# EAGLE design clock (EAGLE 5.11)
FARNELL_PARTNO: AMP 3-1825910-5

## Sheet 1 of 4
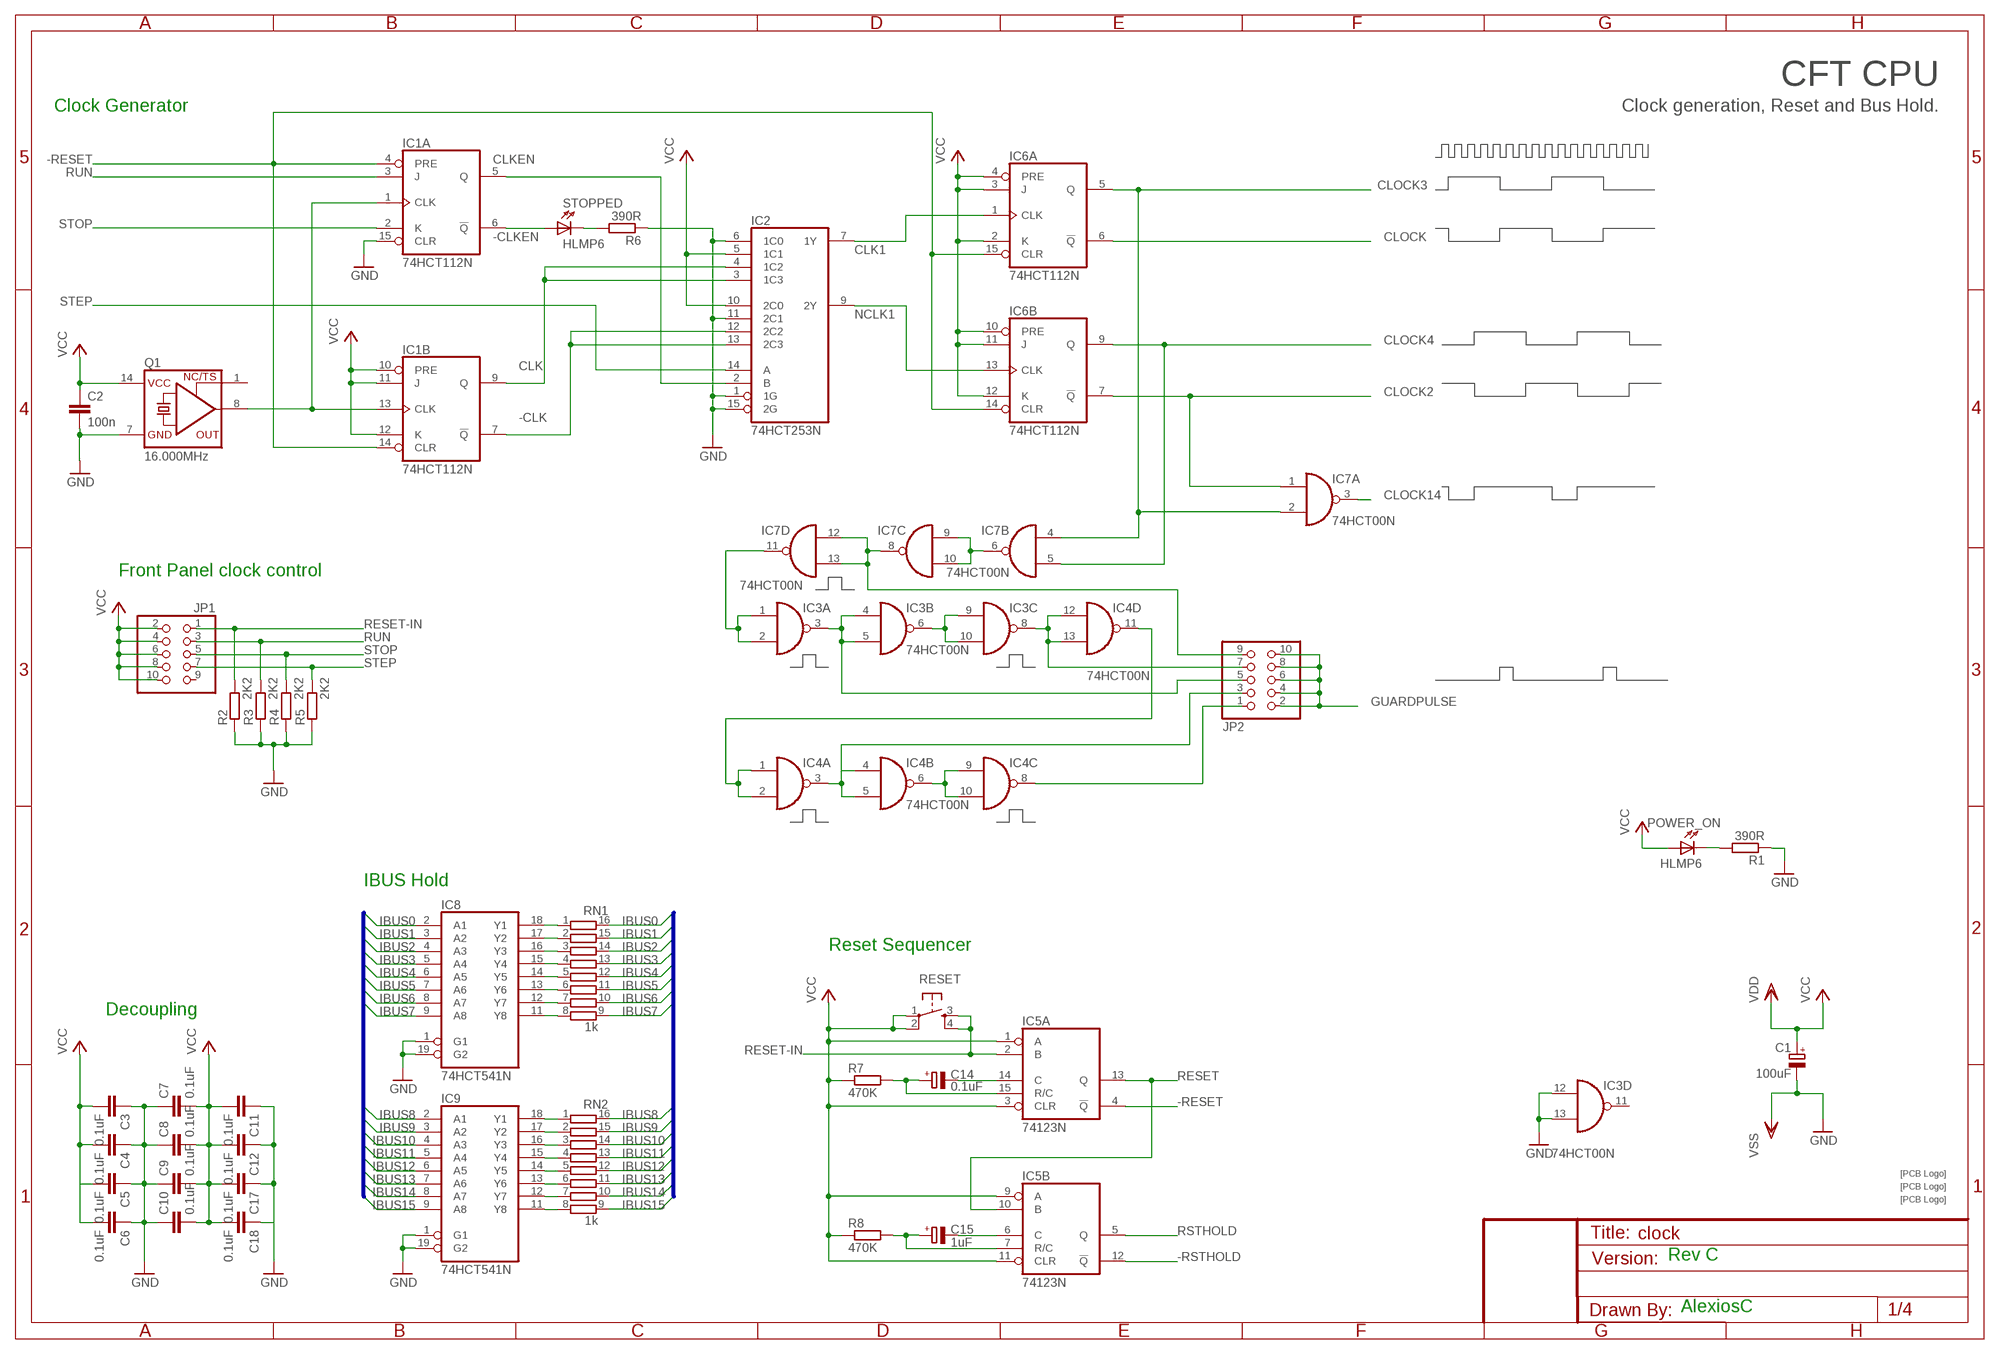
[diagram p0: schematic, sheet 1]

### Parts
C1  100uF  CPOL-EUE2.5-7  [E2,5-7]
C2  100n  C-EU025-025X050  [C025-025X050]
C3  0.1uF  C-EU025-025X050  [C025-025X050]
C4  0.1uF  C-EU025-025X050  [C025-025X050]
C5  0.1uF  C-EU025-025X050  [C025-025X050]
C6  0.1uF  C-EU025-025X050  [C025-025X050]
C7  0.1uF  C-EU025-025X050  [C025-025X050]
C8  0.1uF  C-EU025-025X050  [C025-025X050]
C9  0.1uF  C-EU025-025X050  [C025-025X050]
C10  0.1uF  C-EU025-025X050  [C025-025X050]
C11  0.1uF  C-EU025-025X050  [C025-025X050]
C12  0.1uF  C-EU025-025X050  [C025-025X050]
C14  0.1uF  CPOL-EUE2.5-6  [E2,5-6]
C15  1uF  CPOL-EUE2.5-6  [E2,5-6]
C17  0.1uF  C-EU025-025X050  [C025-025X050]
C18  0.1uF  C-EU025-025X050  [C025-025X050]
IC1  74HCT112N  [DIL16]
IC2  74HCT253N  [DIL16]
IC3  74HCT00N  [DIL14]
IC4  74HCT00N  [DIL14]
IC5  74123N  [DIL16]
IC6  74HCT112N  [DIL16]
IC7  74HCT00N  [DIL14]
IC8  74HCT541N  [DIL20]
IC9  74HCT541N  [DIL20]
JP1  PINHD-2X5/90  [2X05/90]
JP2  PINHD-2X5/90  [2X05/90]
POWER_ON  HLMP6  [HLMP6]
Q1  16.000MHz  XO-14  [DIL14S]
R1  390R  R-EU_0204/7  [0204/7]
R2  2K2  R-EU_0204/7  [0204/7]
R3  2K2  R-EU_0204/7  [0204/7]
R4  2K2  R-EU_0204/7  [0204/7]
R5  2K2  R-EU_0204/7  [0204/7]
R6  390R  R-EU_0204/7  [0204/7]
R7  470K  R-EU_0204/7  [0204/7]
R8  470K  R-EU_0204/7  [0204/7]
RESET  TAC_SWITCHPTH  [TACTILE-PTH]
RN1  1k  8R-P  [DIL16]
RN2  1k  8R-P  [DIL16]
STOPPED  HLMP6  [HLMP6]
U$1  SIGNATUREPLANE  [SIGNATURE_PLANE]
U$2  SIGNATUREPLANE  [SIGNATURE_PLANE]
U$3  SIGNATURESILK  [SIGNATURE]

### Nets
-CLK: IC1.7(B:!Q) IC2.12(2C2) IC2.13(2C3)
-CLKEN: IC1.6(A:!Q) STOPPED.A
-RESET: IC1.4(A:PRE) IC1.14(B:CLR) IC5.4(A:!Q) IC6.14(B:CLR) IC6.15(A:CLR) ; also sheet 2,4
-RSTHOLD: IC5.12(B:!Q) ; also sheet 3,4
CLK: IC1.9(B:Q) IC2.3(1C3) IC2.4(1C2)
CLK1: IC2.7(1Y) IC6.1(A:CLK)
CLKEN: IC1.5(A:Q) IC2.2(B)
CLOCK: IC6.6(A:!Q) ; also sheet 2,4
CLOCK2: IC6.7(B:!Q) IC7.1(A:I0) ; also sheet 4
CLOCK3: IC6.5(A:Q) IC7.2(A:I1) IC7.4(B:I0) ; also sheet 4
CLOCK4: IC6.9(B:Q) IC7.5(B:I1) ; also sheet 4
CLOCK14: IC7.3(A:O) ; also sheet 4
GND [Power]: C1.- C2.1 C3.1 C4.1 C5.1 C6.1 C7.1 C8.1 C9.1 C10.1 C11.1 C12.1 C17.1 C18.1 IC1.15(A:CLR) IC2.1(1G) IC2.6(1C0) IC2.11(2C1) IC2.15(2G) IC3.12(D:I0) IC3.13(D:I1) IC8.1(G1) IC8.19(G2) IC9.1(G1) IC9.19(G2) Q1.7(GND) R1.1 R2.1 R3.1 R4.1 R5.1 R6.1 ; supply symbol labelled VSS ; also sheet 2,3,4
GUARDPULSE: JP2.2 JP2.4 JP2.6 JP2.8 JP2.10 ; also sheet 4
IBUS0: IC8.2(A1) RN1.16 ; also sheet 3,4
IBUS1: IC8.3(A2) RN1.15 ; also sheet 3,4
IBUS2: IC8.4(A3) RN1.14 ; also sheet 3,4
IBUS3: IC8.5(A4) RN1.13 ; also sheet 3,4
IBUS4: IC8.6(A5) RN1.12 ; also sheet 3,4
IBUS5: IC8.7(A6) RN1.11 ; also sheet 3,4
IBUS6: IC8.8(A7) RN1.10 ; also sheet 3,4
IBUS7: IC8.9(A8) RN1.9 ; also sheet 3,4
IBUS8: IC9.2(A1) RN2.16 ; also sheet 3,4
IBUS9: IC9.3(A2) RN2.15 ; also sheet 3,4
IBUS10: IC9.4(A3) RN2.14 ; also sheet 3,4
IBUS11: IC9.5(A4) RN2.13 ; also sheet 3,4
IBUS12: IC9.6(A5) RN2.12 ; also sheet 3,4
IBUS13: IC9.7(A6) RN2.11 ; also sheet 3,4
IBUS14: IC9.8(A7) RN2.10 ; also sheet 3,4
IBUS15: IC9.9(A8) RN2.9 ; also sheet 3,4
N$1: POWER_ON.K R1.2
N$2: IC4.8(C:O) JP2.1
N$3: R6.2 STOPPED.K
N$4: IC8.18(Y1) RN1.1
N$5: IC1.1(A:CLK) IC1.13(B:CLK) Q1.8(OUT)
N$6: C14.+ IC5.15(A:R/C) R7.2
N$8: C14.- IC5.14(A:C)
N$9: C15.+ IC5.7(B:R/C) R8.2
N$10: C15.- IC5.6(B:C)
N$11: IC3.3(A:O) IC3.4(B:I0) IC3.5(B:I1) JP2.5
N$12: IC3.6(B:O) IC3.9(C:I0) IC3.10(C:I1)
N$13: IC3.8(C:O) IC4.12(D:I0) IC4.13(D:I1) JP2.7
N$14: IC4.1(A:I0) IC4.2(A:I1) IC4.11(D:O)
N$15: IC4.3(A:O) IC4.4(B:I0) IC4.5(B:I1) JP2.3
N$16: IC4.6(B:O) IC4.9(C:I0) IC4.10(C:I1)
N$17: IC8.17(Y2) RN1.2
N$18: IC7.6(B:O) IC7.9(C:I0) IC7.10(C:I1)
N$19: IC7.8(C:O) IC7.12(D:I0) IC7.13(D:I1) JP2.9
N$20: IC3.1(A:I0) IC3.2(A:I1) IC7.11(D:O)
N$21: IC8.16(Y3) RN1.3
N$22: IC8.15(Y4) RN1.4
N$23: IC8.14(Y5) RN1.5
N$24: IC8.13(Y6) RN1.6
N$25: IC8.12(Y7) RN1.7
N$26: IC8.11(Y8) RN1.8
N$27: IC9.18(Y1) RN2.1
N$28: IC9.17(Y2) RN2.2
N$29: IC9.16(Y3) RN2.3
N$30: IC9.15(Y4) RN2.4
N$31: IC9.14(Y5) RN2.5
N$32: IC9.13(Y6) RN2.6
N$33: IC9.12(Y7) RN2.7
N$34: IC9.11(Y8) RN2.8
NCLK1: IC2.9(2Y) IC6.13(B:CLK)
RESET: IC5.10(B:B) IC5.13(A:Q)
RESET-IN: IC5.2(A:B) JP1.1 R2.2 RESET.3 RESET.4
RSTHOLD: IC5.5(B:Q)
RUN: IC1.3(A:J) JP1.3 R3.2
STEP: IC2.14(A) JP1.7 R5.2
STOP: IC1.2(A:K) JP1.5 R4.2
VCC [Power]: C1.+ C2.2 C3.2 C4.2 C5.2 C6.2 C7.2 C8.2 C9.2 C10.2 C11.2 C12.2 C17.2 C18.2 IC1.10(B:PRE) IC1.11(B:J) IC1.12(B:K) IC2.5(1C1) IC2.10(2C0) IC5.1(A:A) IC5.3(A:CLR) IC5.9(B:A) IC5.11(B:CLR) IC6.2(A:K) IC6.3(A:J) IC6.4(A:PRE) IC6.10(B:PRE) IC6.11(B:J) IC6.12(B:K) JP1.2 JP1.4 JP1.6 JP1.8 JP1.10 POWER_ON.A Q1.14(VCC) R7.1 R8.1 RESET.1 RESET.2 ; supply symbol labelled VDD ; also sheet 2,3,4
Unconnected: IC3.11(D:O) JP1.9 Q1.1(TS)

### Buses
IBUS[0..15]

### Notes on the sheet
- CFT CPU
- Clock Generator | Clock generation, Reset and Bus Hold.
- Front Panel clock control
- IBUS Hold
- Reset Sequencer
- Decoupling
- Rev C
- AlexiosC

## Sheet 2 of 4
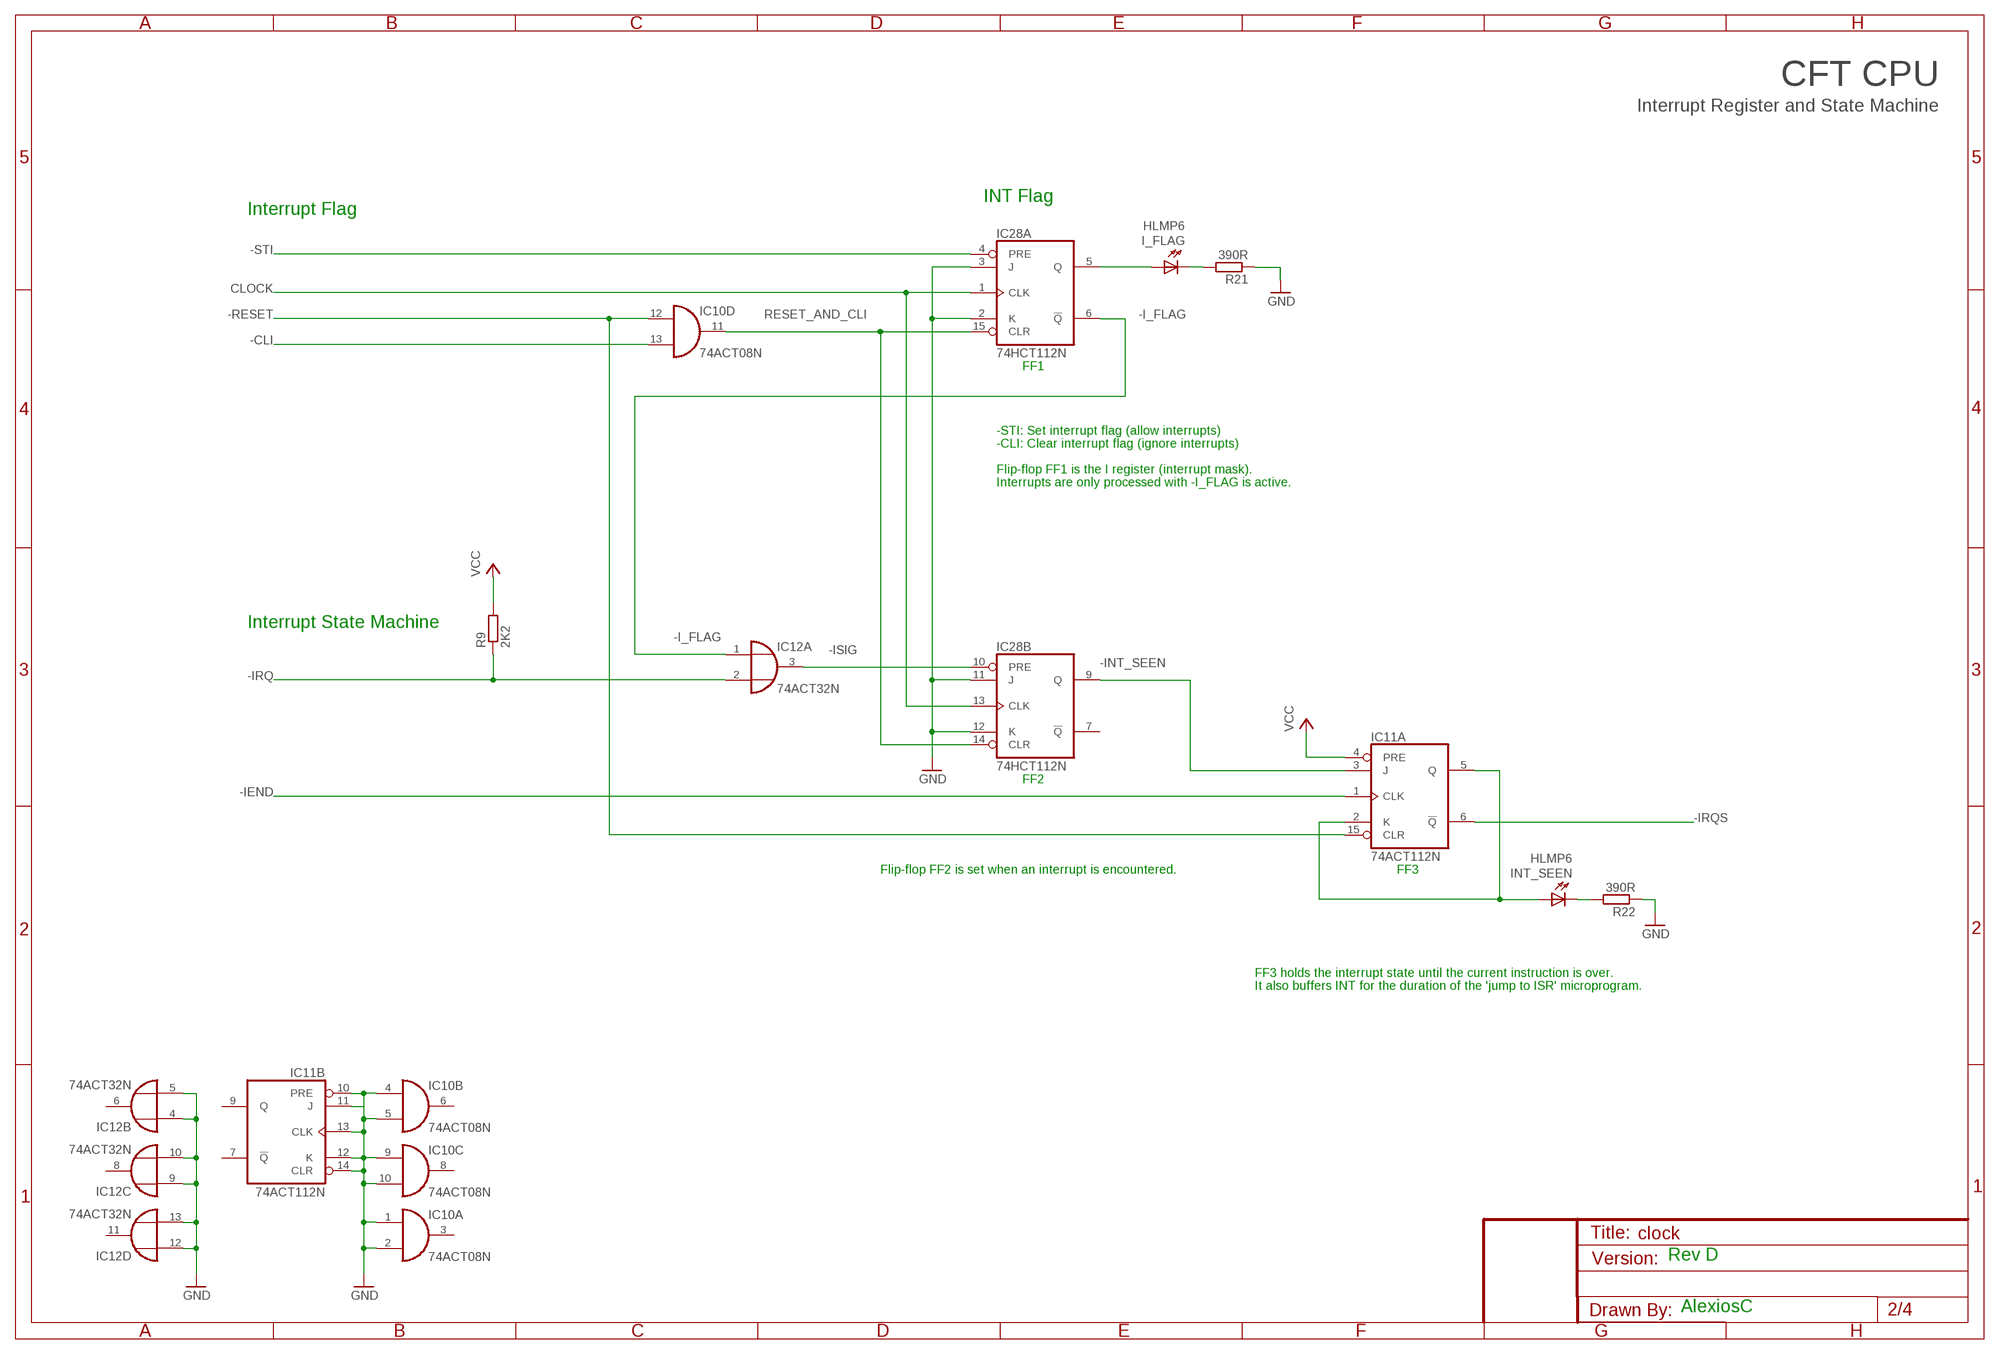
[diagram p1: schematic, sheet 2]

### Parts
I_FLAG  HLMP6  [HLMP6]
IC10  74ACT08N  [DIL14]
IC11  74ACT112N  [DIL16]
IC12  74ACT32N  [DIL14]
IC28  74HCT112N  [DIL16]
INT_SEEN  HLMP6  [HLMP6]
R9  2K2  R-EU_0204/7  [0204/7]
R21  390R  R-EU_0204/7  [0204/7]
R22  390R  R-EU_0204/7  [0204/7]

### Nets
-CLI: IC10.13(D:I1) ; also sheet 4
-I_FLAG: IC12.1(A:I0) IC28.6(A:!Q)
-IEND: IC11.1(A:CLK) ; also sheet 4
-INT_SEEN: IC11.3(A:J) IC28.9(B:Q)
-IRQ: IC12.2(A:I1) R9.1 ; also sheet 4
-IRQS: IC11.2(A:K) IC11.5(A:Q) IC11.6(A:!Q) INT_SEEN.A ; also sheet 4
-ISIG: IC12.3(A:O) IC28.10(B:PRE)
-RESET: IC10.12(D:I0) IC11.15(A:CLR) ; also sheet 1,4
-STI: IC28.4(A:PRE) ; also sheet 4
CLOCK: IC28.1(A:CLK) IC28.13(B:CLK) ; also sheet 1,4
GND [Power]: IC10.1(A:I0) IC10.2(A:I1) IC10.4(B:I0) IC10.5(B:I1) IC10.9(C:I0) IC10.10(C:I1) IC11.10(B:PRE) IC11.11(B:J) IC11.12(B:K) IC11.13(B:CLK) IC11.14(B:CLR) IC12.4(B:I0) IC12.5(B:I1) IC12.9(C:I0) IC12.10(C:I1) IC12.12(D:I0) IC12.13(D:I1) IC28.2(A:K) IC28.3(A:J) IC28.11(B:J) IC28.12(B:K) R21.1 R22.1 ; also sheet 1,3,4
I_FLAG2: I_FLAG.A IC28.5(A:Q)
N$76: I_FLAG.K R21.2
N$77: INT_SEEN.K R22.2
RESET_AND_CLI: IC10.11(D:O) IC28.14(B:CLR) IC28.15(A:CLR)
VCC [Power]: IC11.4(A:PRE) R9.2 ; also sheet 1,3,4
Unconnected: IC10.3(A:O) IC10.6(B:O) IC10.8(C:O) IC11.7(B:!Q) IC11.9(B:Q) IC12.6(B:O) IC12.8(C:O) IC12.11(D:O) IC28.7(B:!Q)

### Notes on the sheet
- CFT CPU
- Interrupt Register and State Machine
- INT Flag
- Interrupt Flag
- FF1
- -STI: Set interrupt flag (allow interrupts)
- -CLI: Clear interrupt flag (ignore interrupts)
- Flip-flop FF1 is the I register (interrupt mask).
- Interrupts are only processed with -I_FLAG is active.
- Interrupt State Machine
- FF2
- Flip-flop FF2 is set when an interrupt is encountered. | FF3
- FF3 holds the interrupt state until the current instruction is over.
- It also buffers INT for the duration of the 'jump to ISR' microprogram.
- Rev D
- AlexiosC

## Sheet 3 of 4
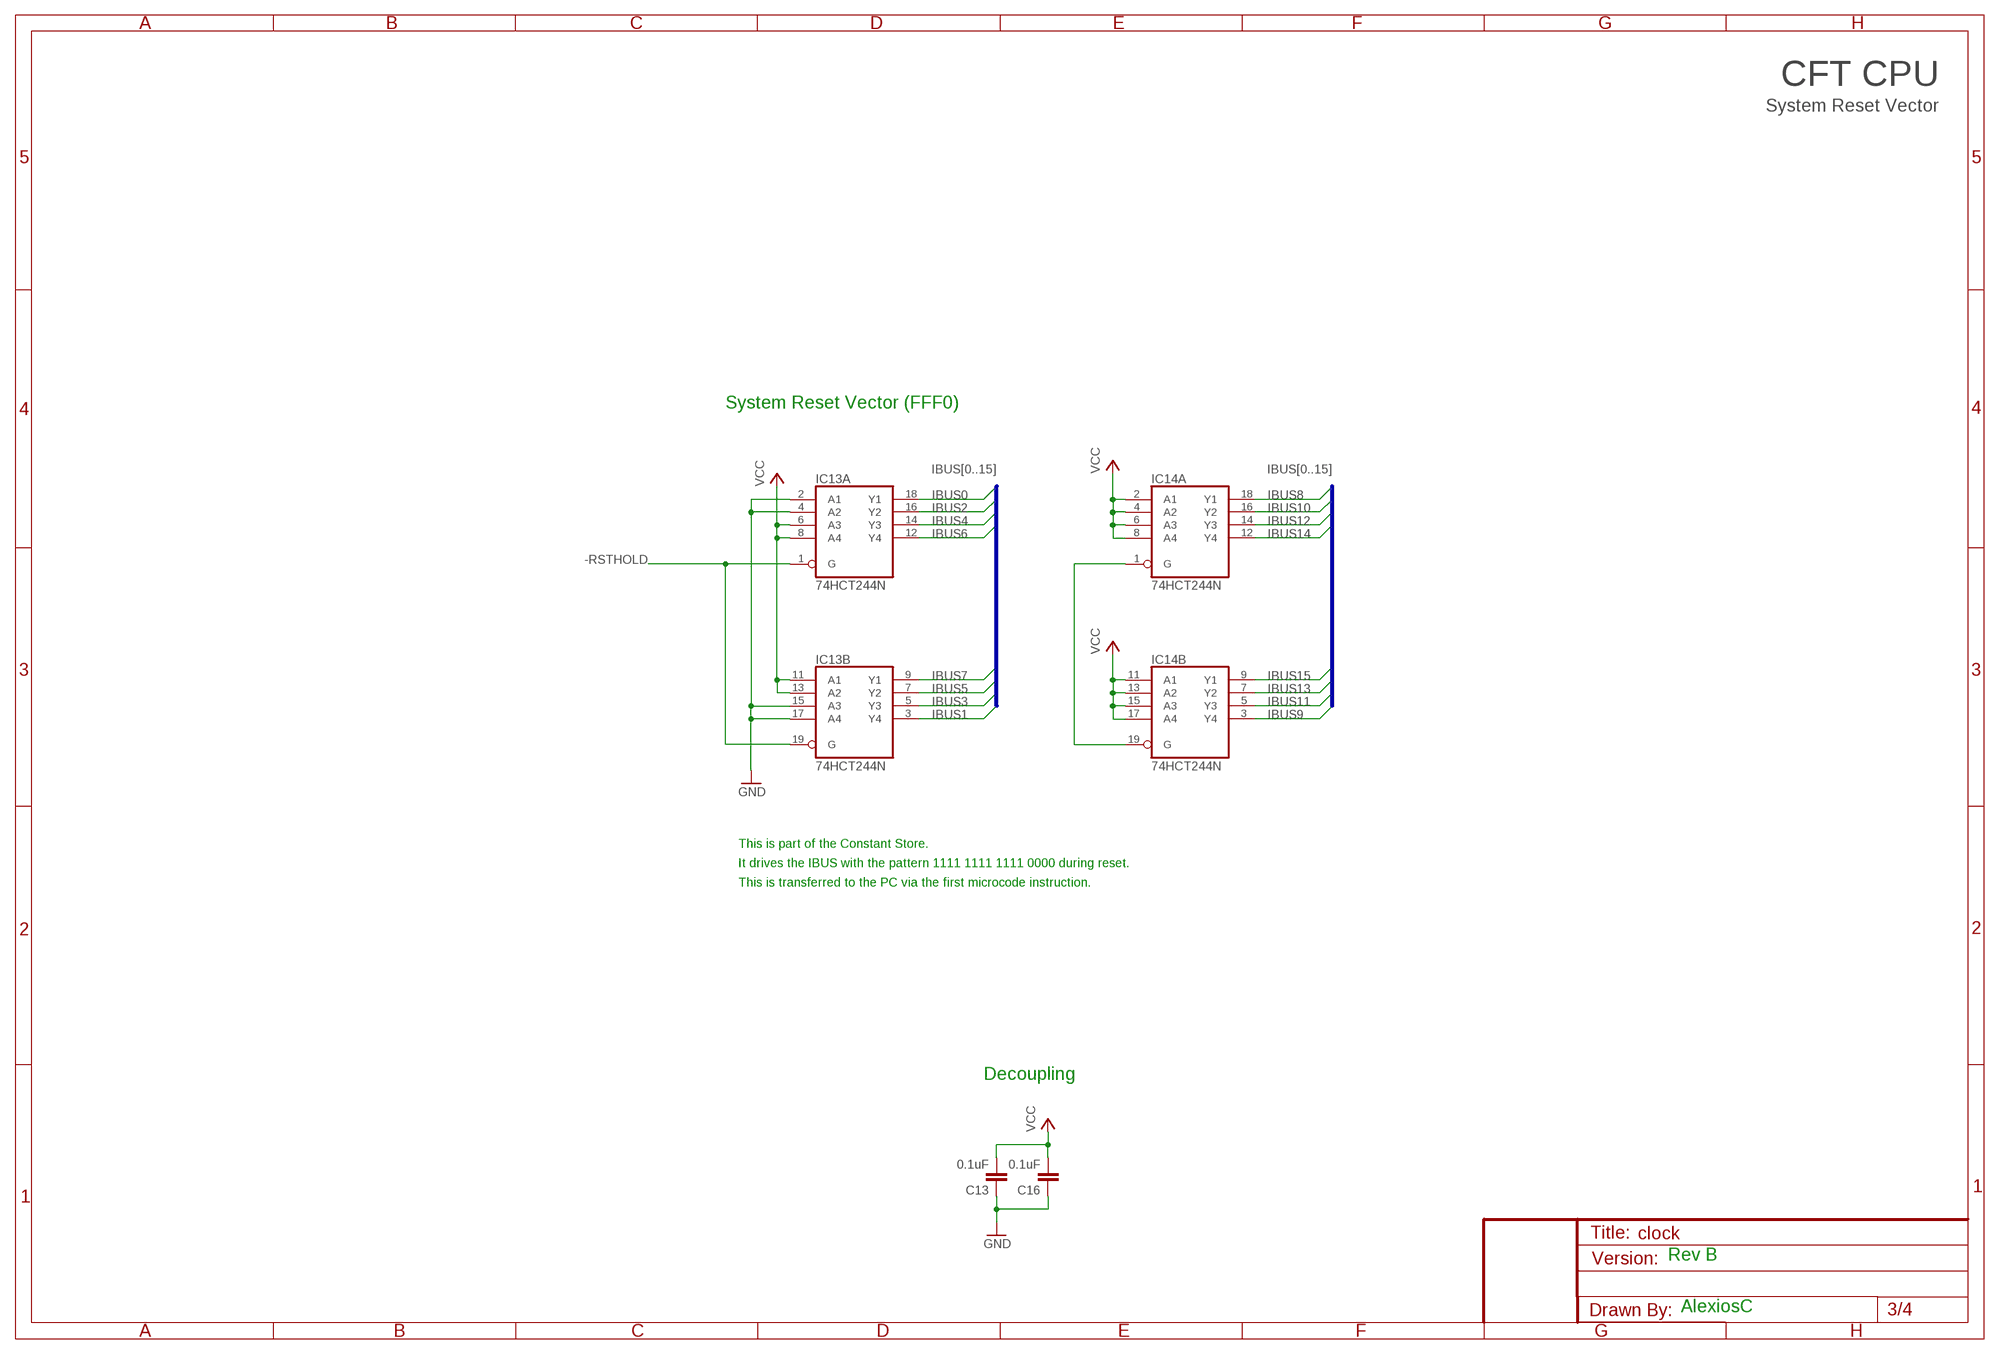
[diagram p2: schematic, sheet 3]

### Parts
C13  0.1uF  C-EU025-025X050  [C025-025X050]
C16  0.1uF  C-EU025-025X050  [C025-025X050]
IC13  74HCT244N  [DIL20]
IC14  74HCT244N  [DIL20]

### Nets
-RSTHOLD: IC13.1(A:G) IC13.19(B:G) ; also sheet 1,4
GND [Power]: C13.1 C16.1 IC13.2(A:A1) IC13.4(A:A2) IC13.15(B:A3) IC13.17(B:A4) ; also sheet 1,2,4
IBUS0: IC13.18(A:Y1) ; also sheet 1,4
IBUS1: IC13.3(B:Y4) ; also sheet 1,4
IBUS2: IC13.16(A:Y2) ; also sheet 1,4
IBUS3: IC13.5(B:Y3) ; also sheet 1,4
IBUS4: IC13.14(A:Y3) ; also sheet 1,4
IBUS5: IC13.7(B:Y2) ; also sheet 1,4
IBUS6: IC13.12(A:Y4) ; also sheet 1,4
IBUS7: IC13.9(B:Y1) ; also sheet 1,4
IBUS8: IC14.18(A:Y1) ; also sheet 1,4
IBUS9: IC14.3(B:Y4) ; also sheet 1,4
IBUS10: IC14.16(A:Y2) ; also sheet 1,4
IBUS11: IC14.5(B:Y3) ; also sheet 1,4
IBUS12: IC14.14(A:Y3) ; also sheet 1,4
IBUS13: IC14.7(B:Y2) ; also sheet 1,4
IBUS14: IC14.12(A:Y4) ; also sheet 1,4
IBUS15: IC14.9(B:Y1) ; also sheet 1,4
N$35: IC14.1(A:G) IC14.19(B:G)
VCC [Power]: C13.2 C16.2 IC13.6(A:A3) IC13.8(A:A4) IC13.11(B:A1) IC13.13(B:A2) IC14.2(A:A1) IC14.4(A:A2) IC14.6(A:A3) IC14.8(A:A4) IC14.11(B:A1) IC14.13(B:A2) IC14.15(B:A3) IC14.17(B:A4) ; also sheet 1,2,4

### Buses
IBUS[0..15]

### Notes on the sheet
- CFT CPU
- System Reset Vector
- System Reset Vector (FFF0)
- This is part of the Constant Store.
- It drives the IBUS with the pattern 1111 1111 1111 0000 during reset.
- This is transferred to the PC via the first microcode instruction.
- Decoupling
- Rev B
- AlexiosC

## Sheet 4 of 4
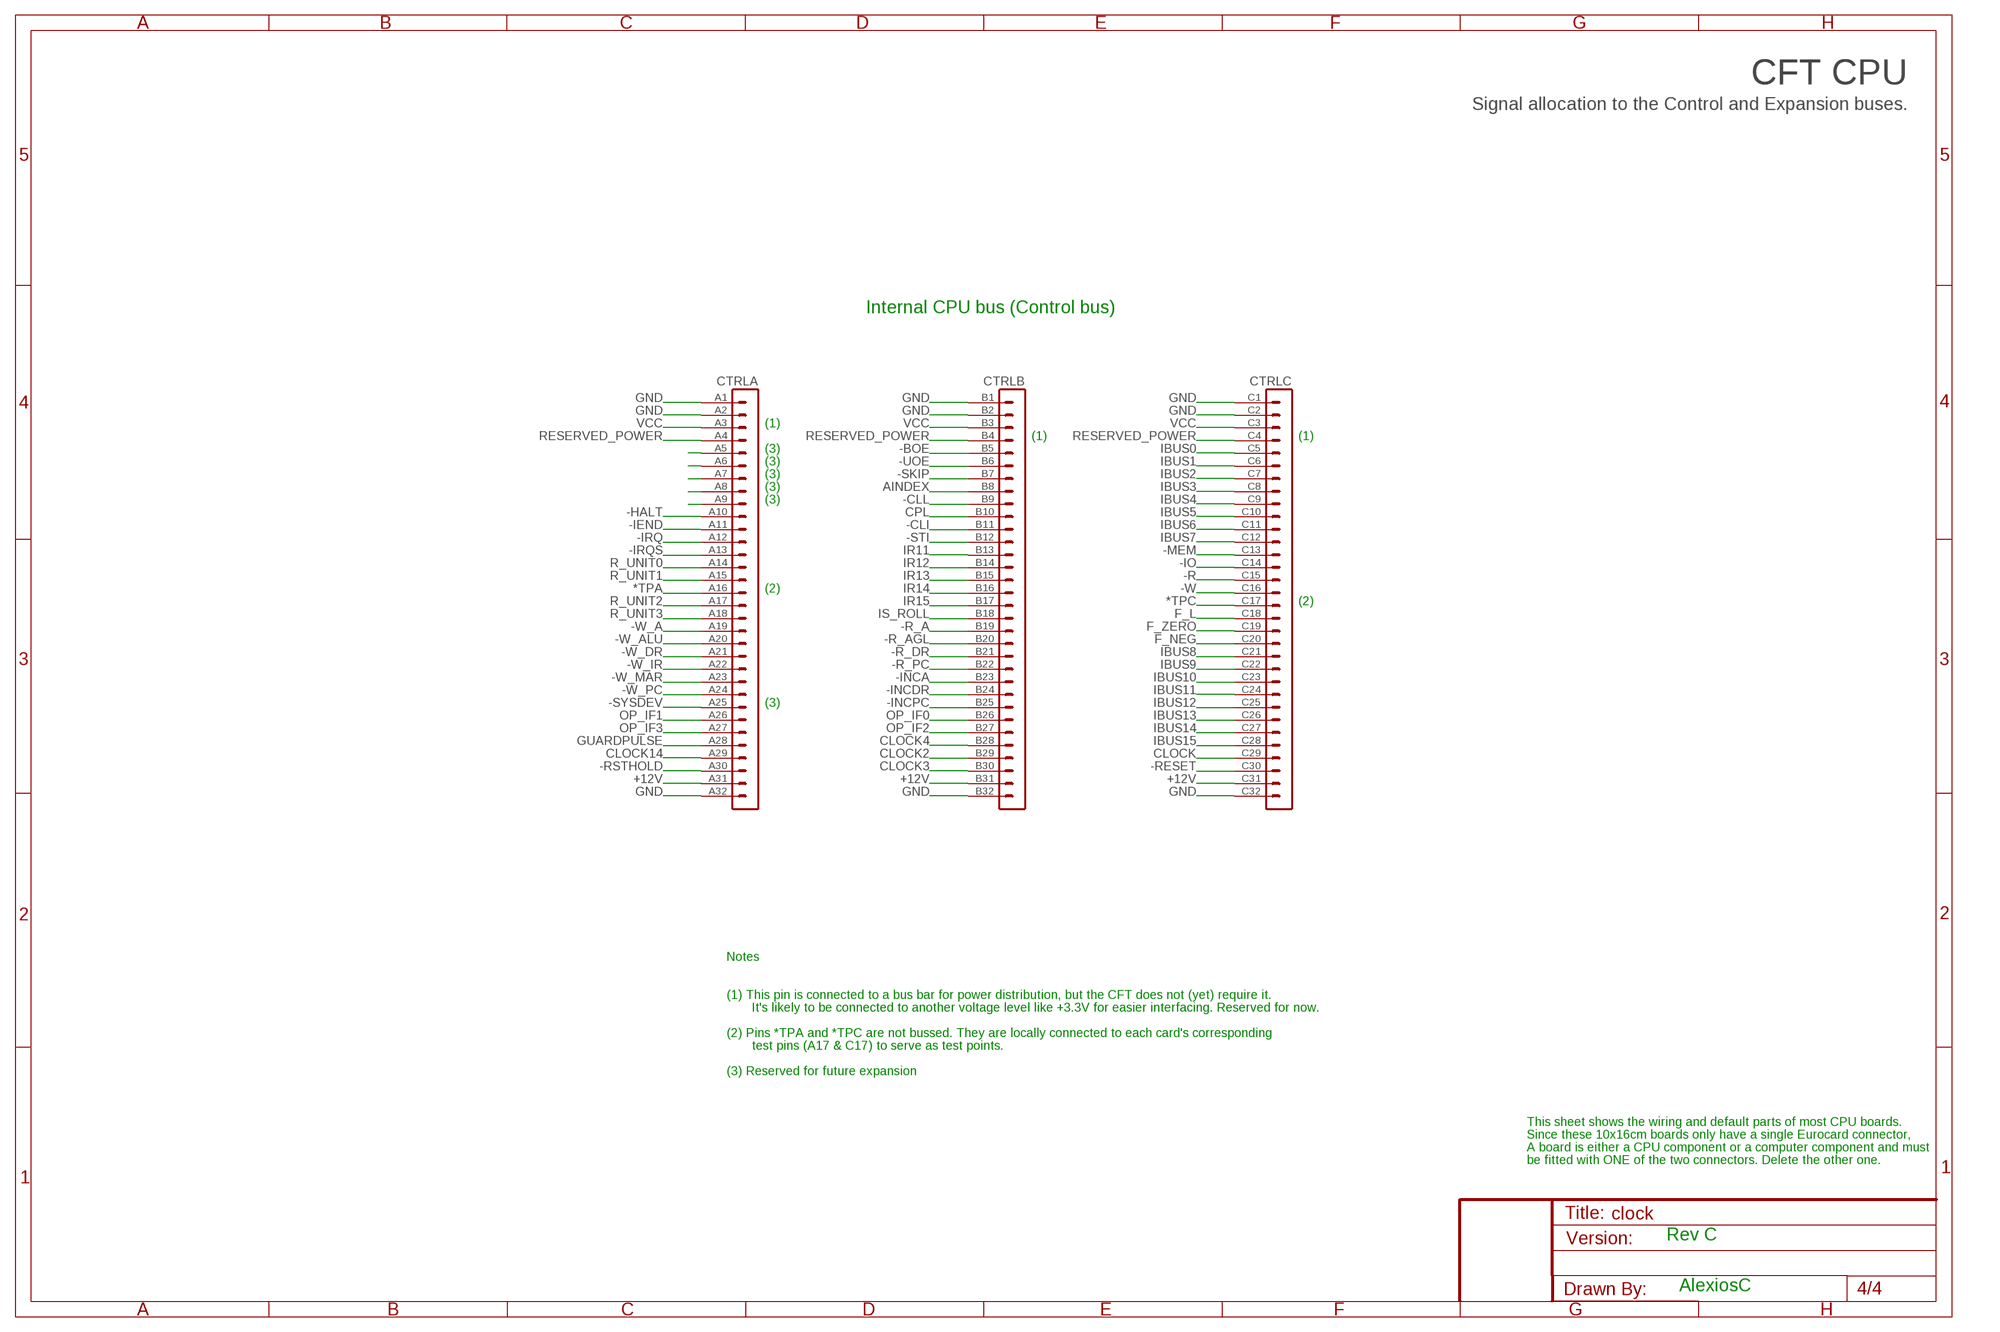
[diagram p3: schematic, sheet 4]

### Parts
CTRL  VG96-3B  [VG96B]

### Nets
*TPA: CTRL.A16
*TPC: CTRL.C17
+12V [12V]: CTRL.A31 CTRL.B31 CTRL.C31
-BOE: CTRL.B5
-CLI: CTRL.B11 ; also sheet 2
-CLL: CTRL.B9
-HALT: CTRL.A10
-IEND: CTRL.A11 ; also sheet 2
-INCA: CTRL.B23
-INCDR: CTRL.B24
-INCPC: CTRL.B25
-IO: CTRL.C14
-IRQ: CTRL.A12 ; also sheet 2
-IRQS: CTRL.A13 ; also sheet 2
-MEM: CTRL.C13
-R: CTRL.C15
-R_A: CTRL.B19
-R_AGL: CTRL.B20
-R_DR: CTRL.B21
-R_PC: CTRL.B22
-RESET: CTRL.C30 ; also sheet 1,2
-RSTHOLD: CTRL.A30 ; also sheet 1,3
-SKIP: CTRL.B7
-STI: CTRL.B12 ; also sheet 2
-SYSDEV: CTRL.A25
-UOE: CTRL.B6
-W: CTRL.C16
-W_A: CTRL.A19
-W_ALU: CTRL.A20
-W_DR: CTRL.A21
-W_IR: CTRL.A22
-W_MAR: CTRL.A23
-W_PC: CTRL.A24
AINDEX: CTRL.B8
CLOCK: CTRL.C29 ; also sheet 1,2
CLOCK2: CTRL.B29 ; also sheet 1
CLOCK3: CTRL.B30 ; also sheet 1
CLOCK4: CTRL.B28 ; also sheet 1
CLOCK14: CTRL.A29 ; also sheet 1
CPL: CTRL.B10
F_L: CTRL.C18
F_NEG: CTRL.C20
F_ZERO: CTRL.C19
GND [Power]: CTRL.A1 CTRL.A2 CTRL.A32 CTRL.B1 CTRL.B2 CTRL.B32 CTRL.C1 CTRL.C2 CTRL.C32 ; also sheet 1,2,3
GUARDPULSE: CTRL.A28 ; also sheet 1
IBUS0: CTRL.C5 ; also sheet 1,3
IBUS1: CTRL.C6 ; also sheet 1,3
IBUS2: CTRL.C7 ; also sheet 1,3
IBUS3: CTRL.C8 ; also sheet 1,3
IBUS4: CTRL.C9 ; also sheet 1,3
IBUS5: CTRL.C10 ; also sheet 1,3
IBUS6: CTRL.C11 ; also sheet 1,3
IBUS7: CTRL.C12 ; also sheet 1,3
IBUS8: CTRL.C21 ; also sheet 1,3
IBUS9: CTRL.C22 ; also sheet 1,3
IBUS10: CTRL.C23 ; also sheet 1,3
IBUS11: CTRL.C24 ; also sheet 1,3
IBUS12: CTRL.C25 ; also sheet 1,3
IBUS13: CTRL.C26 ; also sheet 1,3
IBUS14: CTRL.C27 ; also sheet 1,3
IBUS15: CTRL.C28 ; also sheet 1,3
IR11: CTRL.B13
IR12: CTRL.B14
IR13: CTRL.B15
IR14: CTRL.B16
IR15: CTRL.B17
IS_ROLL: CTRL.B18
N$7: CTRL.A5
N$48: CTRL.A9
N$49: CTRL.A8
N$50: CTRL.A7
N$51: CTRL.A6
OP_IF0: CTRL.B26
OP_IF1: CTRL.A26
OP_IF2: CTRL.B27
OP_IF3: CTRL.A27
R_UNIT0: CTRL.A14
R_UNIT1: CTRL.A15
R_UNIT2: CTRL.A17
R_UNIT3: CTRL.A18
RESERVED_POWER: CTRL.A4 CTRL.B4 CTRL.C4
VCC [Power]: CTRL.A3 CTRL.B3 CTRL.C3 ; also sheet 1,2,3

### Notes on the sheet
- CFT CPU
- Signal allocation to the Control and Expansion buses.
- Internal CPU bus (Control bus)
- (1)
- (1) | (1)
- (3)
- (3)
- (3)
- (3)
- (3)
- (2)
- (2)
- (3)
- Notes
- (1) This pin is connected to a bus bar for power distribution, but the CFT does not (yet) require it.
- It's likely to be connected to another voltage level like +3.3V for easier interfacing. Reserved for now.
- (2) Pins *TPA and *TPC are not bussed. They are locally connected to each card's corresponding
- test pins (A17 & C17) to serve as test points.
- (3) Reserved for future expansion
- This sheet shows the wiring and default parts of most CPU boards.
- Since these 10x16cm boards only have a single Eurocard connector,
- A board is either a CPU component or a computer component and must
- be fitted with ONE of the two connectors. Delete the other one.
- Rev C
- AlexiosC

## Power pins joined to a net without a drawn wire
GND: IC1.8(P:GND) IC2.8(GND) IC3.7(P:GND) IC4.7(P:GND) IC5.8(P:GND) IC6.8(P:GND) IC7.7(P:GND) IC8.10(GND) IC9.10(GND) IC10.7(P:GND) IC11.8(P:GND) IC12.7(P:GND) IC13.10(P:GND) IC14.10(P:GND) IC28.8(P:GND)
VCC: IC1.16(P:VCC) IC2.16(VCC) IC3.14(P:VCC) IC4.14(P:VCC) IC5.16(P:VCC) IC6.16(P:VCC) IC7.14(P:VCC) IC8.20(VCC) IC9.20(VCC) IC10.14(P:VCC) IC11.16(P:VCC) IC12.14(P:VCC) IC13.20(P:VCC) IC14.20(P:VCC) IC28.16(P:VCC)

## Library data of the parts
C1 C14 C15 = rcl:CPOL-EU: POLARIZED CAPACITOR, European symbol
C2-C13 C16-C18 = rcl:C-EU: CAPACITOR, European symbol
CTRL = 19inch:VG96-3: PCB EUROCARD, 96-pin type C/ABC, 2.54 mm
I_FLAG INT_SEEN POWER_ON STOPPED = display-hp:HLMP6: LED 2mm horizontal; MF: AGILENT TECHNOLOGIES; MPN: HLMP-6500; OC_FARNELL: 1652490; OC_NEWARK: 40K0088
IC1 IC6 IC11 IC28 = 74xx-eu:74*112: Dual J-K negative edge triggered FLIP FLOP, preset and clear
IC2 = 74xx-eu:74*253: Dual 4-to 1 line data SELECTOR/MULTIPLEXER, 3-state
IC3 IC4 IC7 = 74xx-eu:74*00: Quad 2-input NAND gate
IC5 = 74xx-eu:74*123: Retriggerable monostable MULTIVIBRATOR
IC8 IC9 = 74xx-eu:74*541: Octal BUFFER and LINE DRIVER, 3-state
IC10 = 74xx-eu:74*08: Quad 2-input AND gate
IC12 = 74xx-eu:74*32: Quad 2-input OR gate
IC13 IC14 = 74xx-eu:74*244: Octal BUFFER and LINE DRIVER, 3-state
JP1 JP2 = pinhead:PINHD-2X5: PIN HEADER
Q1 = crystal:XO-14: CRYSTAL RESONATOR
R1-R9 R21 R22 = resistor:R-EU_: RESISTOR, European symbol
RESET = SparkFun:TAC_SWITCH: Momentary Switch Button commonly used for reset or general input. Spark Fun Electronics SKU : COM-00097
RN1 RN2 = resistor-dil:8R-P: DIL RESISTOR; OC_FARNELL: unknown; OC_NEWARK: unknown
U$1-U$3 = alexios:SIGNATURE: Soup signature

## Net classes
1 Power: width 0.914 mm, clearance 0.61 mm
2 12V: width 1.016 mm, clearance 1.016 mm

## Board
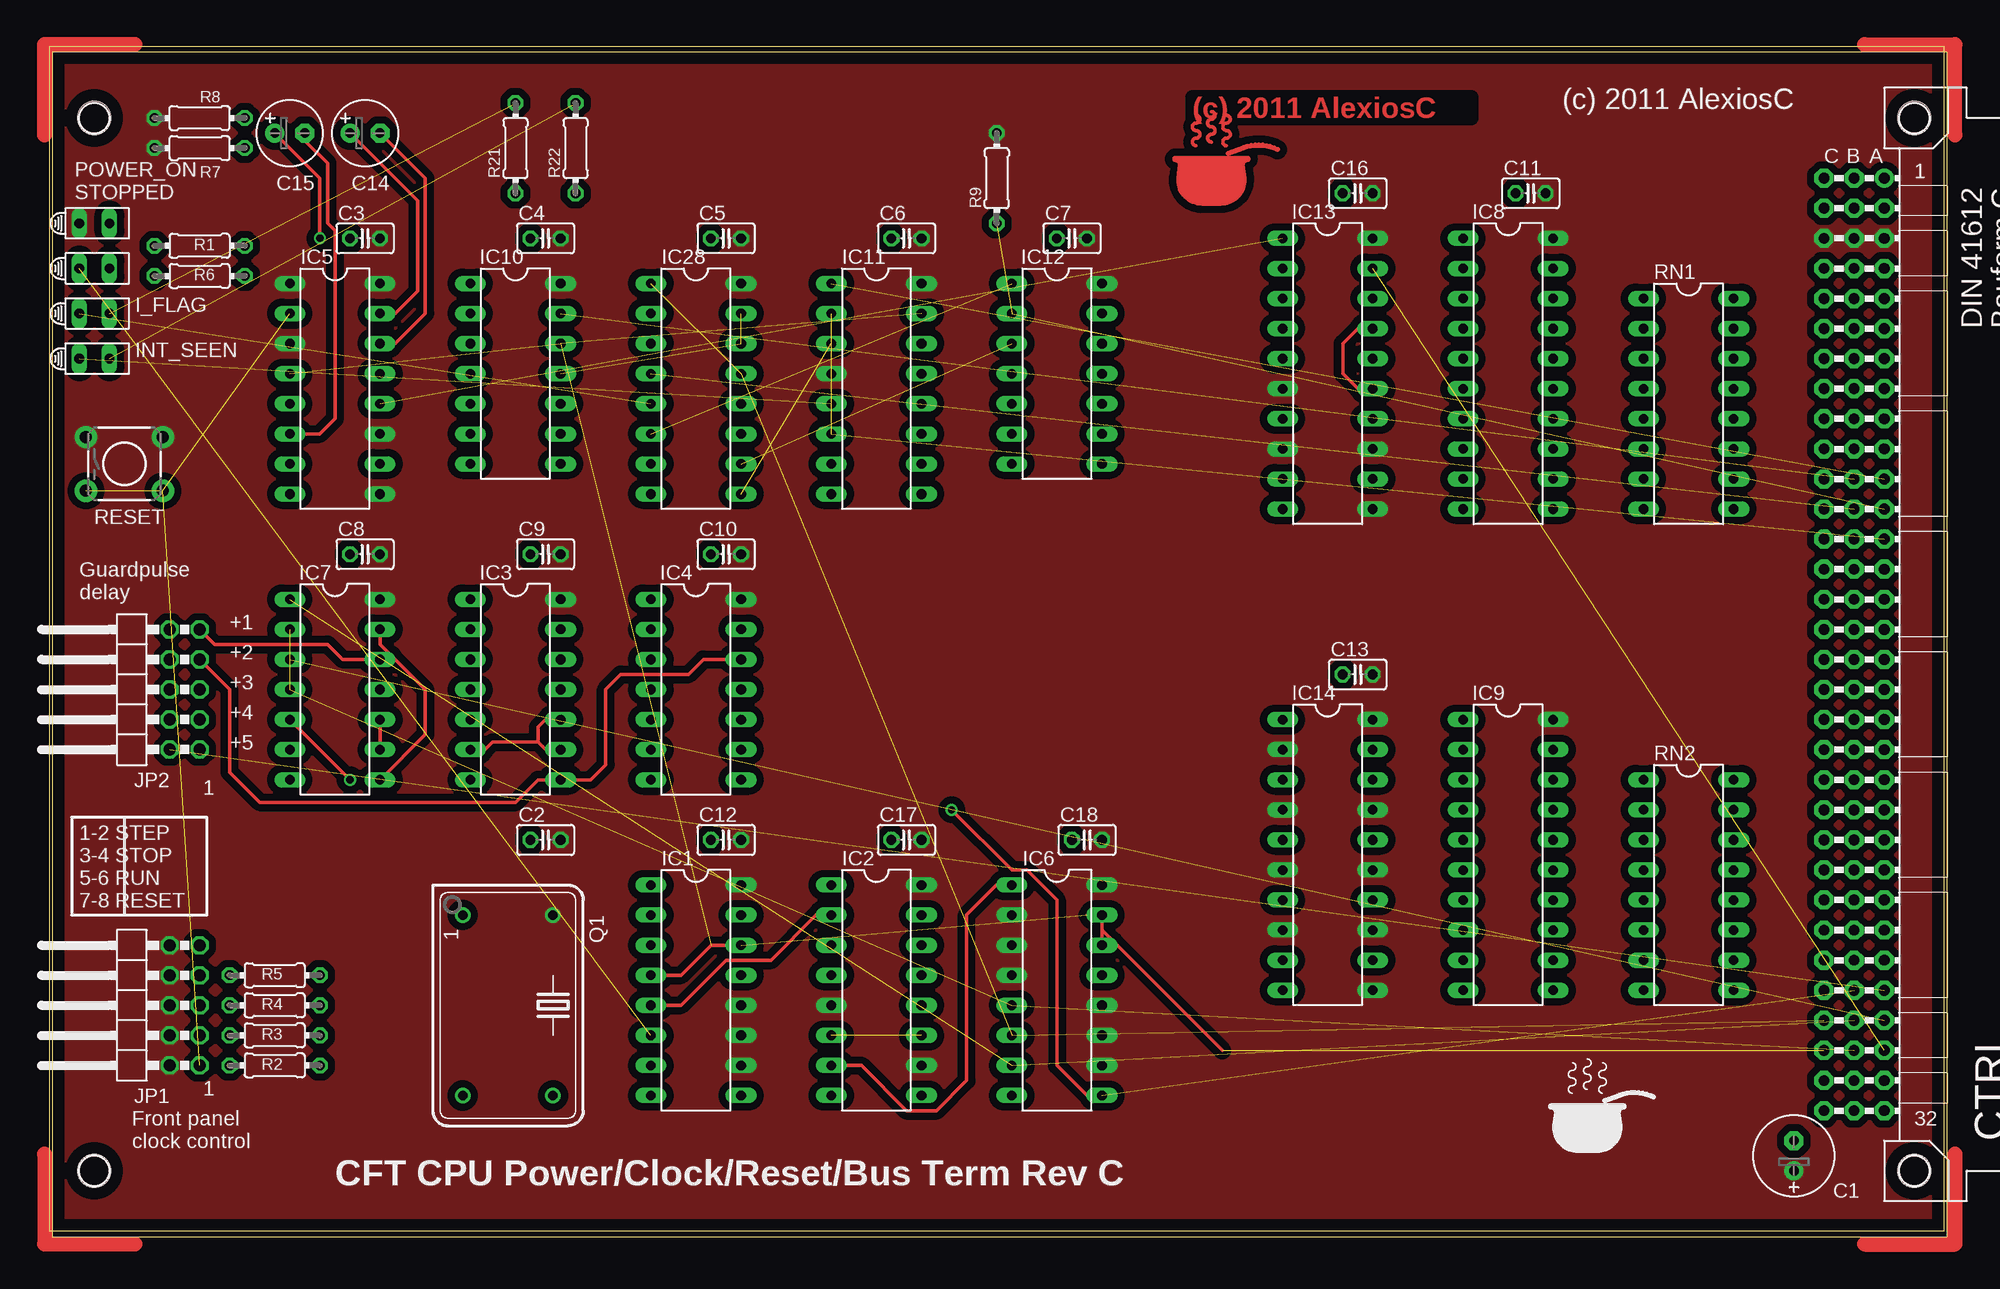
[diagram p4: board, top side]
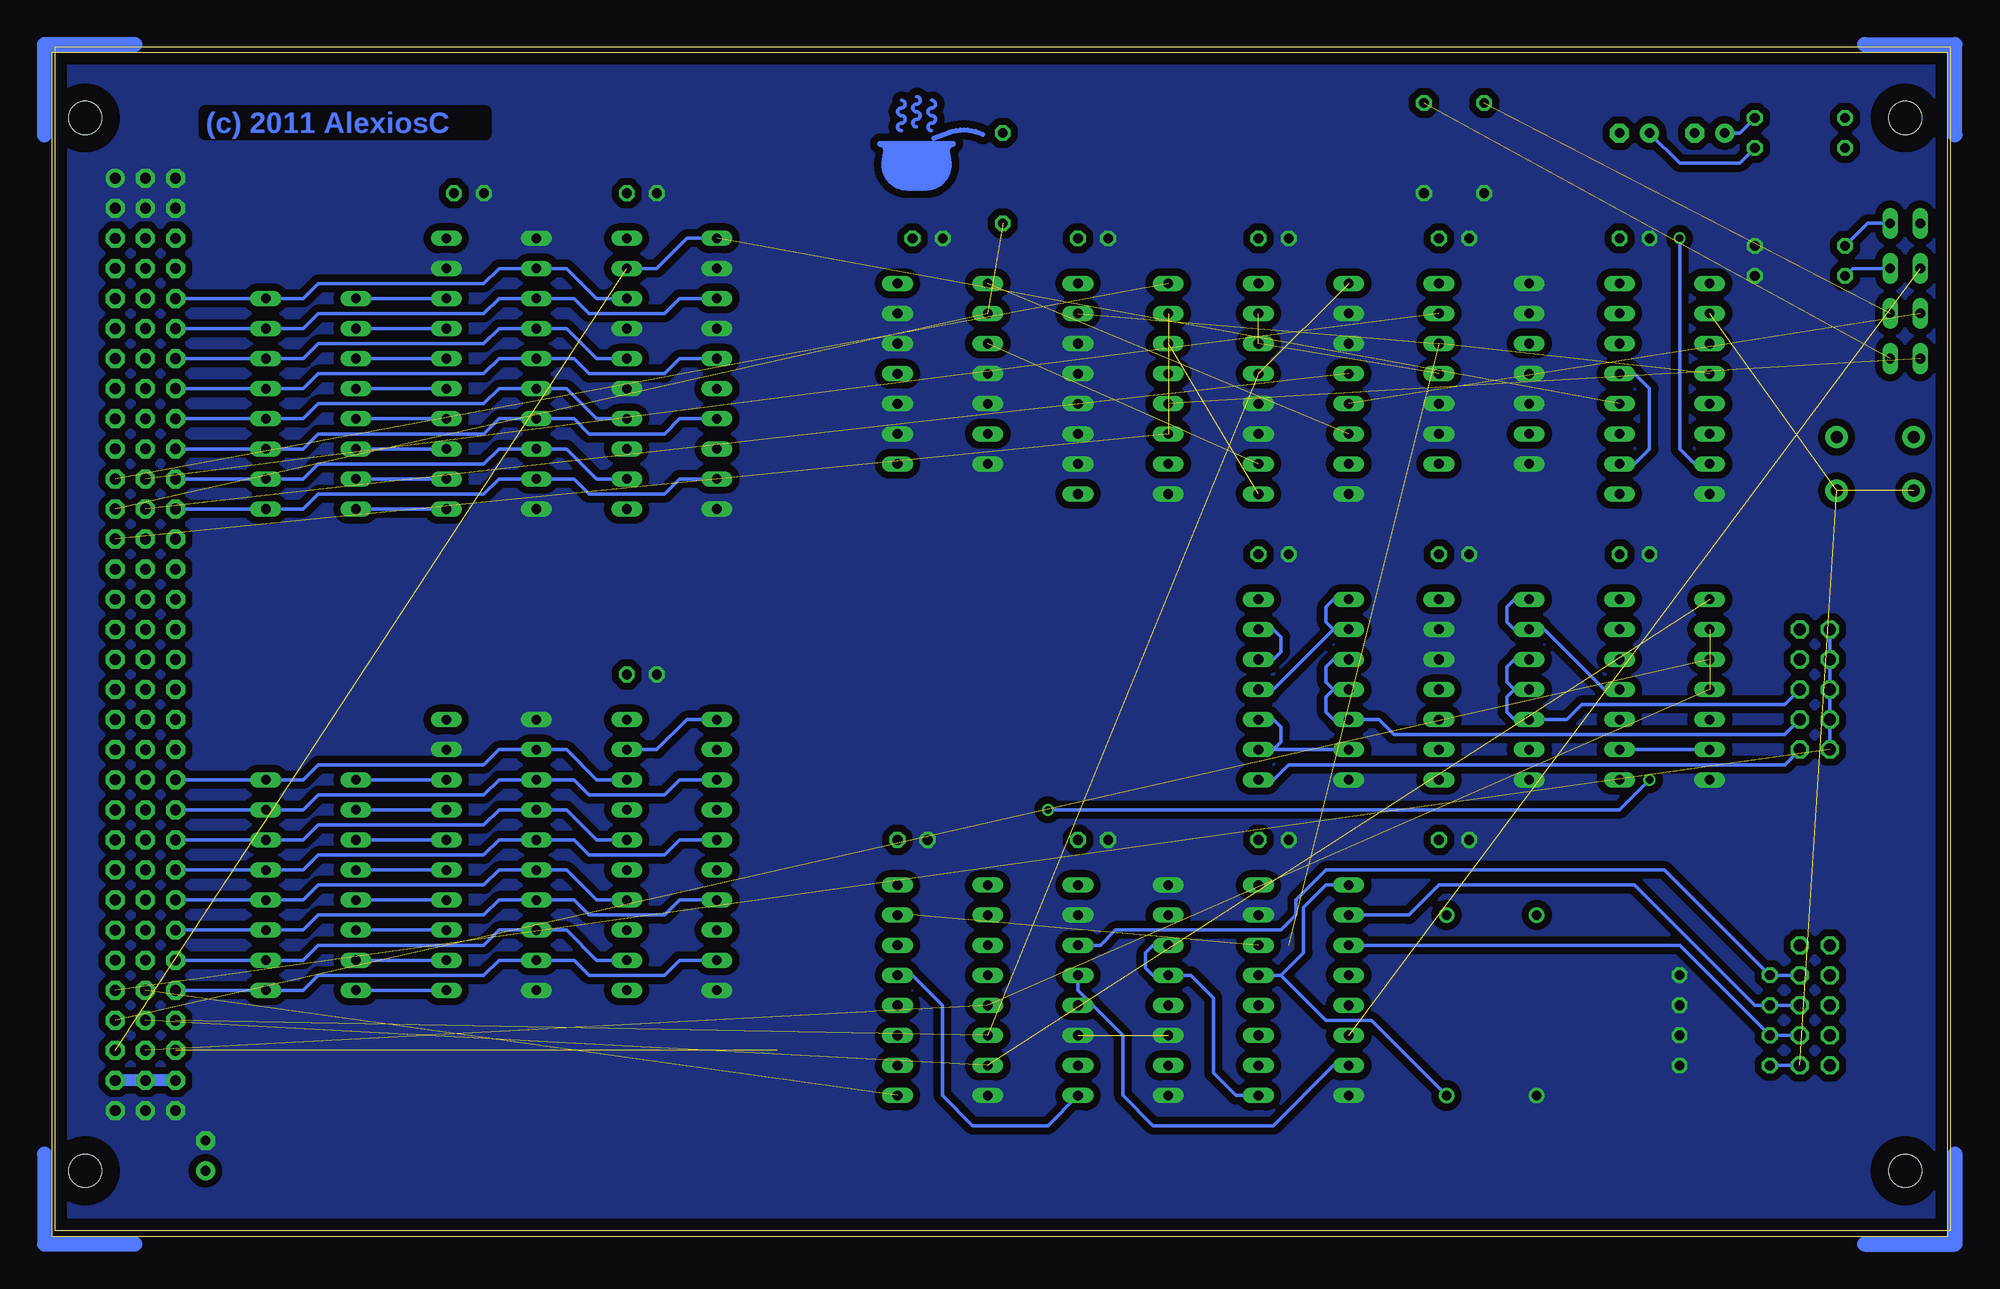
[diagram p5: board, bottom side, seen from below]

Size 160 x 100 mm. Coordinates in mm from the lower left corner, seen from the top.
Outline: 0,0 160,0 160,100 0,100 0,0
Copper layers (1*16): Top 0.035mm / dielectric 1.5mm / Bottom 0.035mm
Design rules "olimex-10mil": minimum track width 10mil, minimum drill 24mil, track to track 10mil, track to pad 10mil, pad to pad 10mil, via to via 10mil, smd to smd 10mil, copper to edge 40mil, drill to drill 10mil, minimum pad ring 10mil, minimum via ring 8mil, stop-mask expansion 0mil, vias tented up to drill 0mil, thermal gap 10mil

### Footprints (pad centres in the part's own frame; a part is rotated, then mirrored left to right if it is on the bottom)
E2,5-7 = drill 0.813 pad 1.6 round: + -1.27,0 | drill 0.813 pad 1.6 octagon: - 1.27,0
C025-025X050 = drill 0.813 octagon: 1 -1.27,0; 2 1.27,0
E2,5-6 = drill 0.813 pad 1.6 round: + -1.27,0 | drill 0.813 pad 1.6 octagon: - 1.27,0
VG96B = drill 0.914 pad 1.6 round: A1 154.94,39.37 | drill 0.914 pad 1.6 octagon: A2 154.94,36.83; A3 154.94,34.29; A4 154.94,31.75; A5 154.94,29.21; A6 154.94,26.67; A7 154.94,24.13; A8 154.94,21.59; A9 154.94,19.05; A10 154.94,16.51; A11 154.94,13.97; A12 154.94,11.43; A13 154.94,8.89; A14 154.94,6.35; A15 154.94,3.81; A16 154.94,1.27; A17 154.94,-1.27; A18 154.94,-3.81; A19 154.94,-6.35; A20 154.94,-8.89; A21 154.94,-11.43; A22 154.94,-13.97; A23 154.94,-16.51; A24 154.94,-19.05; A25 154.94,-21.59; A26 154.94,-24.13; A27 154.94,-26.67; A28 154.94,-29.21; A29 154.94,-31.75; A30 154.94,-34.29; A31 154.94,-36.83; A32 154.94,-39.37; B1 152.4,39.37; B2 152.4,36.83; B3 152.4,34.29; B4 152.4,31.75; B5 152.4,29.21; B6 152.4,26.67; B7 152.4,24.13; B8 152.4,21.59; B9 152.4,19.05; B10 152.4,16.51; B11 152.4,13.97; B12 152.4,11.43; B13 152.4,8.89; B14 152.4,6.35; B15 152.4,3.81; B16 152.4,1.27; B17 152.4,-1.27; B18 152.4,-3.81; B19 152.4,-6.35; B20 152.4,-8.89; B21 152.4,-11.43; B22 152.4,-13.97; B23 152.4,-16.51; B24 152.4,-19.05; B25 152.4,-21.59; B26 152.4,-24.13; B27 152.4,-26.67; B28 152.4,-29.21; B29 152.4,-31.75; B30 152.4,-34.29; B31 152.4,-36.83; B32 152.4,-39.37; C1 149.86,39.37; C2 149.86,36.83; C3 149.86,34.29; C4 149.86,31.75; C5 149.86,29.21; C6 149.86,26.67; C7 149.86,24.13; C8 149.86,21.59; C9 149.86,19.05; C10 149.86,16.51; C11 149.86,13.97; C12 149.86,11.43; C13 149.86,8.89; C14 149.86,6.35; C15 149.86,3.81; C16 149.86,1.27; C17 149.86,-1.27; C18 149.86,-3.81; C19 149.86,-6.35; C20 149.86,-8.89; C21 149.86,-11.43; C22 149.86,-13.97; C23 149.86,-16.51; C24 149.86,-19.05; C25 149.86,-21.59; C26 149.86,-24.13; C27 149.86,-26.67; C28 149.86,-29.21; C29 149.86,-31.75; C30 149.86,-34.29; C31 149.86,-36.83; C32 149.86,-39.37 | hole 2.794: 157.48,44.45; 157.48,-44.45; 3.81,44.45; 3.81,-44.45
HLMP6 = drill 0.813 long: A -1.27,0; K 1.27,0
DIL16 = drill 0.813 long: 1 -8.89,-3.81; 2 -6.35,-3.81; 3 -3.81,-3.81; 4 -1.27,-3.81; 5 1.27,-3.81; 6 3.81,-3.81; 7 6.35,-3.81; 8 8.89,-3.81; 9 8.89,3.81; 10 6.35,3.81; 11 3.81,3.81; 12 1.27,3.81; 13 -1.27,3.81; 14 -3.81,3.81; 15 -6.35,3.81; 16 -8.89,3.81
DIL14 = drill 0.813 long: 1 -7.62,-3.81; 2 -5.08,-3.81; 3 -2.54,-3.81; 4 0,-3.81; 5 2.54,-3.81; 6 5.08,-3.81; 7 7.62,-3.81; 8 7.62,3.81; 9 5.08,3.81; 10 2.54,3.81; 11 0,3.81; 12 -2.54,3.81; 13 -5.08,3.81; 14 -7.62,3.81
DIL20 = drill 0.813 long: 1 -11.43,-3.81; 2 -8.89,-3.81; 3 -6.35,-3.81; 4 -3.81,-3.81; 5 -1.27,-3.81; 6 1.27,-3.81; 7 3.81,-3.81; 8 6.35,-3.81; 9 8.89,-3.81; 10 11.43,-3.81; 11 11.43,3.81; 12 8.89,3.81; 13 6.35,3.81; 14 3.81,3.81; 15 1.27,3.81; 16 -1.27,3.81; 17 -3.81,3.81; 18 -6.35,3.81; 19 -8.89,3.81; 20 -11.43,3.81
2X05/90 = drill 1.016 octagon: 1 -5.08,-6.35; 2 -5.08,-3.81; 3 -2.54,-6.35; 4 -2.54,-3.81; 5 0,-6.35; 6 0,-3.81; 7 2.54,-6.35; 8 2.54,-3.81; 9 5.08,-6.35; 10 5.08,-3.81
DIL14S = drill 0.813 round: 1 -7.62,-3.81; 7 7.62,-3.81; 8 7.62,3.81; 14 -7.62,3.81
0204/7 = drill 0.813 octagon: 1 -3.81,0; 2 3.81,0
TACTILE-PTH = drill 1.016 pad 1.88 round: 1 -3.251,2.261; 2 3.251,2.261; 3 -3.251,-2.261; 4 3.251,-2.261

### Placement (x,y rotation side)
C1  147.32,6.35 90 top
C2  41.91,33.02 0 top
C3  26.67,83.82 0 top
C4  41.91,83.82 0 top
C5  57.15,83.82 0 top
C6  72.39,83.82 0 top
C7  86.36,83.82 0 top
C8  26.67,57.15 0 top
C9  41.91,57.15 0 top
C10  57.15,57.15 0 top
C11  125.09,87.63 0 top
C12  57.15,33.02 0 top
C13  110.49,46.99 0 top
C14  26.67,92.71 0 top
C15  20.32,92.71 0 top
C16  110.49,87.63 0 top
C17  72.39,33.02 0 top
C18  87.63,33.02 0 top
CTRL  0,49.53 0 top
I_FLAG  3.81,77.47 0 top
IC1  54.61,20.32 270 top
IC2  69.85,20.32 270 top
IC3  39.37,45.72 270 top
IC4  54.61,45.72 270 top
IC5  24.13,71.12 270 top
IC6  85.09,20.32 270 top
IC7  24.13,45.72 270 top
IC8  123.19,72.39 270 top
IC9  123.19,31.75 270 top
IC10  39.37,72.39 270 top
IC11  69.85,71.12 270 top
IC12  85.09,72.39 270 top
IC13  107.95,72.39 270 top
IC14  107.95,31.75 270 top
IC28  54.61,71.12 270 top
INT_SEEN  3.81,73.66 0 top
JP1  6.35,19.05 90 top
JP2  6.35,45.72 90 top
POWER_ON  3.81,85.09 0 top
Q1  38.73,19.05 270 top
R1  12.7,83.19 180 top
R2  19.05,13.97 180 top
R3  19.05,16.51 180 top
R4  19.05,19.05 180 top
R5  19.05,21.59 180 top
R6  12.7,80.64 180 top
R7  12.7,91.44 0 top
R8  12.7,93.98 0 top
R9  80.01,88.9 90 top
R21  39.37,91.44 90 top
R22  44.45,91.44 90 top
RESET  6.35,64.77 0 top
RN1  138.43,69.85 270 top
RN2  138.43,29.21 270 top
STOPPED  3.81,81.28 0 top
U$1  95.25,86.36 0 top
U$2  90.17,87.63 0 bottom
U$3  127,6.35 0 top

### Tracks (layer width: path | path; a pad name or v marks a point on that pad's centre or on a via)
+12V
  Bottom 1.016: CTRL.C31 CTRL.B31 CTRL.A31
-CLI  (1 unrouted)
-CLK
  Bottom 0.305: IC1.7 52.07,13.97 57.15,8.89 67.31,8.89 69.85,11.43 69.85,16.51 72.39,19.05 | 72.39,19.05 73.66,20.32 IC2.13 | 72.39,19.05 IC2.12
-CLKEN  (1 unrouted)
-I_FLAG  (1 unrouted)
-IEND  (1 unrouted)
-INT_SEEN  (1 unrouted)
-IRQ  (2 unrouted)
-IRQS  (4 unrouted)
-ISIG  (1 unrouted)
-RESET  (5 unrouted)
  Top 0.305: IC1.4 53.34,21.59 55.88,24.13 IC1.14 | 88.9,25.4 IC6.15 87.63,26.67 | IC6.14 88.9,25.4 | 88.9,25.4 99.06,15.24
-RSTHOLD  (2 unrouted)
  Bottom 0.305: IC13.1 106.68,83.82 109.22,81.28 IC13.19
-STI  (1 unrouted)
CLK
  Bottom 0.305: IC1.9 60.33,11.43 62.23,13.34 62.23,19.68 64.14,21.59 IC2.4 67.31,21.59 67.94,22.23 67.94,23.5 67.31,24.13 IC2.3
CLK1
  Top 0.305: IC2.7 68.58,13.97 72.39,10.16 74.93,10.16 77.47,12.7 77.47,26.67 80.01,29.21 IC6.1
CLKEN
  Top 0.305: IC1.5 53.34,19.05 57.15,22.86 60.96,22.86 64.77,26.67 IC2.2
CLOCK  (3 unrouted)
CLOCK2  (2 unrouted)
CLOCK3  (3 unrouted)
CLOCK4  (via drill 0.61)  (1 unrouted)
  Top 0.305: IC7.5 v25.4,38.1 | v76.2,35.56 81.28,30.48 82.55,30.48 85.09,27.94 85.09,13.97 87.63,11.43 IC6.9
  Bottom 0.305: v25.4,38.1 27.94,35.56 v76.2,35.56
CLOCK14  (1 unrouted)
GND  (1 unrouted)
  Top 0.305: IC13.17 110.49,76.2 109.22,74.93 109.22,72.39 110.49,71.12 IC13.15
  pour Bottom (isolate 0.61, no thermals): 0,100.33 0,0 160.02,0 160.02,100.33
GUARDPULSE  (1 unrouted)
  Bottom 0.305: JP2.10 JP2.8 JP2.6 JP2.4 JP2.2
I_FLAG2  (1 unrouted)
IBUS0
  Bottom 0.305: CTRL.C5 RN1.16 139.06,78.74 137.79,80.01 123.83,80.01 122.56,81.28 IC8.2 116.84,81.28 114.3,78.74 IC13.18
IBUS1
  Bottom 0.305: CTRL.C6 RN1.15 139.06,76.2 137.79,77.47 123.83,77.47 122.56,78.74 IC8.3 116.2,78.74 114.94,77.47 108.58,77.47 107.31,78.74 IC13.3
IBUS2
  Bottom 0.305: CTRL.C7 RN1.14 139.06,73.66 137.79,74.93 123.83,74.93 122.56,76.2 IC8.4 116.84,76.2 114.3,73.66 IC13.16
IBUS3
  Bottom 0.305: CTRL.C8 RN1.13 139.06,71.12 137.79,72.39 123.83,72.39 122.56,73.66 IC8.5 116.2,73.66 114.94,72.39 108.58,72.39 107.31,73.66 IC13.5
IBUS4
  Bottom 0.305: CTRL.C9 RN1.12 139.06,68.58 137.79,69.85 123.83,69.85 122.56,71.12 IC8.6 116.84,71.12 114.3,68.58 IC13.14
IBUS5
  Bottom 0.305: CTRL.C10 RN1.11 139.06,66.04 137.79,67.31 123.83,67.31 122.56,68.58 IC8.7 116.2,68.58 114.94,67.31 108.58,67.31 107.31,68.58 IC13.7
IBUS6
  Bottom 0.305: CTRL.C11 RN1.10 139.06,63.5 137.79,64.77 123.83,64.77 122.56,66.04 IC8.8 116.84,66.04 114.3,63.5 IC13.12
IBUS7
  Bottom 0.305: CTRL.C12 RN1.9 139.06,60.96 137.79,62.23 123.83,62.23 122.56,63.5 IC8.9 116.2,63.5 114.94,62.23 108.58,62.23 107.31,63.5 IC13.9
IBUS8
  Bottom 0.305: CTRL.C21 RN2.16 139.06,38.1 137.79,39.37 123.83,39.37 122.56,40.64 IC9.2 116.84,40.64 114.3,38.1 IC14.18
IBUS9
  Bottom 0.305: CTRL.C22 RN2.15 139.06,35.56 137.79,36.83 123.83,36.83 122.56,38.1 IC9.3 116.2,38.1 114.94,36.83 108.58,36.83 107.31,38.1 IC14.3
IBUS10
  Bottom 0.305: CTRL.C23 RN2.14 139.06,33.02 137.79,34.29 123.83,34.29 122.56,35.56 IC9.4 116.84,35.56 114.3,33.02 IC14.16
IBUS11
  Bottom 0.305: CTRL.C24 RN2.13 139.06,30.48 137.79,31.75 123.83,31.75 122.56,33.02 IC9.5 116.2,33.02 114.94,31.75 108.58,31.75 107.31,33.02 IC14.5
IBUS12
  Bottom 0.305: CTRL.C25 RN2.12 139.06,27.94 137.79,29.21 123.83,29.21 122.56,30.48 IC9.6 116.84,30.48 114.3,27.94 IC14.14
IBUS13
  Bottom 0.305: CTRL.C26 RN2.11 139.06,25.4 137.79,26.67 123.83,26.67 122.56,27.94 IC9.7 116.2,27.94 114.94,26.67 108.58,26.67 107.31,27.94 IC14.7
IBUS14
  Bottom 0.305: CTRL.C27 RN2.10 139.06,22.86 137.79,24.13 123.83,24.13 122.56,25.4 IC9.8 116.84,25.4 114.3,22.86 IC14.12
IBUS15
  Bottom 0.305: CTRL.C28 RN2.9 139.06,20.32 137.79,21.59 123.83,21.59 122.56,22.86 IC9.9 116.2,22.86 114.94,21.59 108.58,21.59 107.31,22.86 IC14.9
N$1
  Bottom 0.305: POWER_ON.K 6.99,85.09 R1.2
N$2
  Bottom 0.305: IC4.8 57.15,38.1 55.88,39.37 13.97,39.37 JP2.1
N$3
  Bottom 0.305: STOPPED.K 8.26,81.28 R6.2
N$4
  Bottom 0.305: IC8.18 RN1.1
N$5
  Bottom 0.305: Q1.8 48.9,17.78 52.7,17.78 56.52,21.59 | 56.52,21.59 IC1.13 | 56.52,21.59 54.61,23.5 54.61,27.3 52.7,29.21 IC1.1
N$6
  Top 0.305: IC5.15 29.21,77.47 31.11,79.38 31.11,87 C14.+
  Bottom 0.305: R7.2 17.78,90.17 22.86,90.17 C14.+
N$8
  Top 0.305: IC5.14 29.21,74.93 31.75,77.47 31.75,88.9 C14.-
N$9  (via drill 0.6)
  Top 0.305: C15.+ 22.86,88.9 v22.86,83.82
  Bottom 0.305: C15.+ 17.78,92.71 R8.2 | v22.86,83.82 22.86,66.04 21.59,64.77 IC5.7
N$10
  Top 0.305: IC5.6 22.86,67.31 24.13,68.58 24.13,84.45 23.5,85.09 23.5,90.17 21.59,92.08 C15.-
N$11
  Bottom 0.305: IC3.3 36.83,48.26 37.47,47.62 37.47,46.35 36.83,45.72 | 36.83,45.72 IC3.4 | 36.83,45.72 37.47,45.09 37.47,43.81 36.83,43.18 IC3.5 32.38,43.18 31.11,44.45 13.97,44.45 JP2.5
N$12
  Top 0.305: IC3.10 41.91,43.18 41.27,42.55 41.27,41.27 | 41.27,41.27 41.91,40.64 IC3.9 | IC3.6 36.83,40.64 37.47,41.27 41.27,41.27
N$13
  Top 0.305: JP2.7 15.24,45.72 15.24,38.73 17.78,36.2 39.37,36.2 41.27,38.1 IC3.8 45.72,38.1 46.99,39.37 46.99,45.72 48.26,46.99 53.98,46.99 55.24,48.26 IC4.12
  Bottom 0.305: IC4.13 57.15,50.8 56.52,50.16 56.52,48.9 57.15,48.26 IC4.12
N$14
  Bottom 0.305: IC4.1 52.07,53.34 52.7,52.7 52.7,51.44 52.07,50.8 | IC4.2 52.07,50.8 | IC4.11 57.15,45.72 52.07,50.8
N$15
  Bottom 0.305: IC4.3 52.07,48.26 52.7,47.62 52.7,46.35 52.07,45.72 | 52.07,45.72 IC4.4 | 52.07,45.72 52.7,45.09 52.7,43.81 52.07,43.18 IC4.5 48.26,43.18 46.99,41.91 13.97,41.91 JP2.3
N$16
  Bottom 0.305: IC4.6 57.15,40.64 | 57.15,40.64 IC4.9 | IC4.10 57.15,43.18 56.52,42.55 56.52,41.27 57.15,40.64
N$17
  Bottom 0.305: IC8.17 RN1.2
N$18
  Top 0.305: IC7.9 IC7.10
  Bottom 0.305: IC7.6 IC7.9
N$19
  Top 0.305: JP2.9 13.97,49.53 23.5,49.53 24.77,48.26 IC7.12 29.21,48.26 | IC7.8 31.75,41.91 31.75,45.72 29.21,48.26 | 29.21,48.26 27.94,49.53 IC7.13
N$20
  Bottom 0.305: IC3.1 36.83,53.34 37.47,52.7 37.47,51.44 36.83,50.8 IC3.2 34.29,50.8 29.21,45.72 IC7.11
N$21
  Bottom 0.305: IC8.16 RN1.3
N$22
  Bottom 0.305: IC8.15 RN1.4
N$23
  Bottom 0.305: IC8.14 RN1.5
N$24
  Bottom 0.305: IC8.13 RN1.6
N$25
  Bottom 0.305: IC8.12 RN1.7
N$26
  Bottom 0.305: IC8.11 RN1.8
N$27
  Bottom 0.305: IC9.18 RN2.1
N$28
  Bottom 0.305: IC9.17 RN2.2
N$29
  Bottom 0.305: IC9.16 RN2.3
N$30
  Bottom 0.305: IC9.15 RN2.4
N$31
  Bottom 0.305: IC9.14 RN2.5
N$32
  Bottom 0.305: IC9.13 RN2.6
N$33
  Bottom 0.305: IC9.12 RN2.7
N$34
  Bottom 0.305: IC9.11 RN2.8
N$35
  Bottom 0.305: IC14.1 106.68,43.18 109.22,40.64 IC14.19
N$76  (1 unrouted)
N$77  (1 unrouted)
NCLK1
  Bottom 0.305: IC2.9 76.2,8.89 82.55,8.89 85.09,11.43 85.09,19.05 87.63,21.59 IC6.13
RESERVED_POWER
  Top 0.305: CTRL.C4 CTRL.B4 CTRL.A4
RESET
  Bottom 0.305: IC5.13 26.67,72.39 25.4,71.12 25.4,66.04 26.67,64.77 IC5.10
RESET-IN  (3 unrouted)
  Bottom 0.305: JP1.1 R2.2
RESET_AND_CLI  (2 unrouted)
RUN
  Bottom 0.305: JP1.3 R3.2 22.86,24.13 IC1.3
STEP
  Bottom 0.305: JP1.7 R5.2 24.13,30.48 52.7,30.48 55.24,27.94 55.24,26.67 56.52,25.4 70.48,25.4 71.75,24.13 IC2.14
STOP
  Bottom 0.305: JP1.5 R4.2 16.51,19.05 26.67,29.21 43.18,29.21 45.72,26.67 IC1.2
VCC
  pour Top (isolate 0.61, rank 2, no thermals): 0,100.33 0,0 160.02,0 160.02,100.33

### Text on the board
Top: (c) 2011 AlexiosC
Bottom: (c) 2011 AlexiosC
tNames: (c) 2011 AlexiosC | Guardpulse | delay | +1 | +2 | +3 | +4 | +5 | 1 | 1-2 STEP | 3-4 STOP | 5-6 RUN | 7-8 RESET | 1 | Front panel | clock control | CFT CPU Power/Clock/Reset/Bus Term Rev C
tValues: +12V | +5V | GND